# Altium project MainBoard_V100.PrjPcb (part 3 of 3)
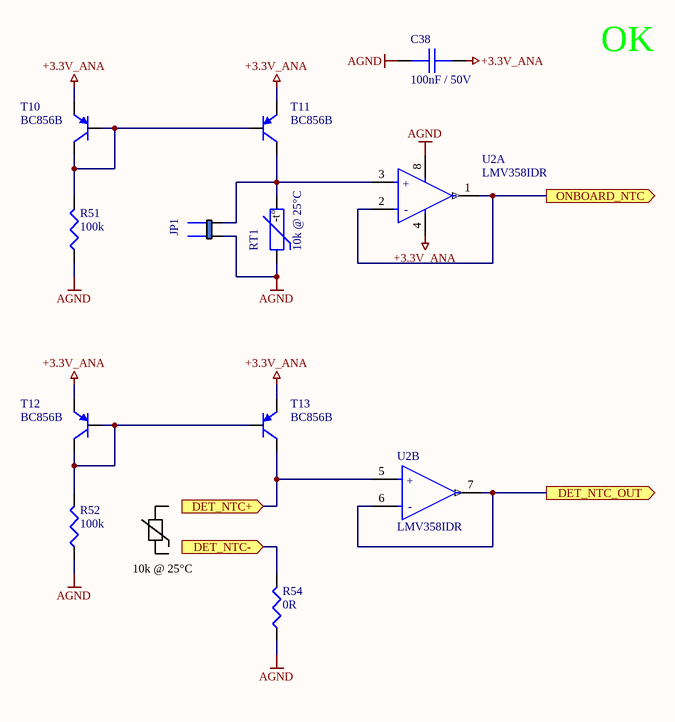
[diagram p22: MainBoard_V100_TEMP.SchDoc]

## Nets that join several sheets
+3.3V: MainBoard_V100_PSU_DIG (S7.2), MainBoard_V100_CHARGER (R72.2), MainBoard_V100_CON (12 pins), MainBoard_V100_MEM (6 pins), MainBoard_V100_ON_OFF (T5.3), MainBoard_V100_SD (8 pins), MainBoard_V100_PER (D5.K LS1.1), MainBoard_V100_MCU (23 pins), MainBoard_V100_BLE (C54.2 C55.2 R59.2 U23.14), MainBoard_V100_DISP (IC2.2)
+3.3V_ANA: MainBoard_V100_PSU_AFE (S5.2), MainBoard_V100_BLR (C46.1 U18.7), MainBoard_V100_CSP (C59.1 C60.1 U3.7 U4.7), MainBoard_V100_PEAKDET (10 pins), MainBoard_V100_MCU (U11.21), MainBoard_V100_TEMP (6 pins)
+3.3V_REF: MainBoard_V100_PSU_AFE (U17.2), MainBoard_V100_MCU (U11.20)
+5V: MainBoard_V100_PSU_AFE (C39.1 U14.1), MainBoard_V100_PSU_5V (S8.2)
+V_AUX: MainBoard_V100_ON_OFF (12 pins), MainBoard_V100_USB_MUX (C56.2 U22.10)
+VBAT: MainBoard_V100_CHARGER (5 pins), MainBoard_V100_ON_OFF (C9.2 U7.1 U7.3)
+VBAT_AUX: MainBoard_V100_CHARGER (BH2.1), MainBoard_V100_MCU (D7.A)
+VBUS: MainBoard_V100_PSU (R70.2 S1.2), MainBoard_V100_PSU_DIG (C49.1 C50.1 IC1.4 IC1.5), MainBoard_V100_PSU_DET (C25.1 L2.1 R38.2 U15.6), MainBoard_V100_PSU_5V (C16.1 C33.1 IC4.4 IC4.5)
+VDET: MainBoard_V100_PSU_DET (S4.2), MainBoard_V100_CON (CON5.1 CON5.2)
+VSYS: MainBoard_V100_PSU (R1.2 T1.3), MainBoard_V100_CHARGER (C15.2 C17.2 U12.15 U12.16)
+VUSB: MainBoard_V100_CHARGER (C14.2 R31.1 R115.2 U12.23), MainBoard_V100_CON (D1.5 S2.2)
-3.3V_ANA: MainBoard_V100_PSU_AFE (S6.2), MainBoard_V100_BLR (C48.2 R124.1 R125.1 U18.4), MainBoard_V100_CSP (C63.2 C64.2 U3.4 U4.4), MainBoard_V100_PEAKDET (C65.2 C82.2 U1.4 U20.4)
AGND: MainBoard_V100_PSU_DET (6 pins), MainBoard_V100_PSU_AFE (21 pins), MainBoard_V100_CON (CON5.5 CON5.6 CON5.9 CON5.10), MainBoard_V100_BLR (C46.2 C48.1 R123.1 U18.3), MainBoard_V100_CSP (8 pins), MainBoard_V100_PEAKDET (13 pins), MainBoard_V100_MCU (FB3.2 U11.19), MainBoard_V100_TEMP (7 pins)
GND: MainBoard_V100_PSU (C94.2 R2.1 R71.1 T2.2), MainBoard_V100_PSU_DIG (5 pins), MainBoard_V100_PSU_DET (8 pins), MainBoard_V100_PSU_AFE (C39.2 FB7.1 U14.2), MainBoard_V100_CHARGER (22 pins), MainBoard_V100_PSU_5V (5 pins), MainBoard_V100_CON (29 pins), MainBoard_V100_MEM (C7.1 U6.4), MainBoard_V100_ON_OFF (12 pins), MainBoard_V100_SD (9 pins), MainBoard_V100_USB_MUX (C56.1 R62.1 R113.1 U22.5), MainBoard_V100_PER (5 pins), MainBoard_V100_MCU (28 pins), MainBoard_V100_BLE (C54.1 C55.1 U23.2 U23.13), MainBoard_V100_DISP (IC2.1 IC2.40 R112.1)
#BLE_RST: MainBoard_V100_MCU (U11.96), MainBoard_V100_BLE (R59.1 U23.10)
BUTTON_0: MainBoard_V100_PER (CON4.9), MainBoard_V100_MCU (U11.4)
BUTTON_1: MainBoard_V100_PER (CON4.8), MainBoard_V100_MCU (U11.3)
BUTTON_2: MainBoard_V100_PER (CON4.7), MainBoard_V100_MCU (U11.2)
BUTTON_3: MainBoard_V100_PER (CON4.6), MainBoard_V100_MCU (U11.1)
BUTTON_4: MainBoard_V100_PER (CON4.5), MainBoard_V100_MCU (U11.89)
BUTTON_5: MainBoard_V100_PER (CON4.4), MainBoard_V100_MCU (U11.34)
BUTTON_6: MainBoard_V100_PER (CON4.3), MainBoard_V100_MCU (U11.33)
BUTTON_7: MainBoard_V100_PER (CON4.2), MainBoard_V100_MCU (U11.32)
BUTTON_8: MainBoard_V100_ON_OFF (D4.A R20.1 R21.1), MainBoard_V100_PER (CON4.1)
DET_NTC+: MainBoard_V100_CON (CON5.11 CON5.12 D10.3), MainBoard_V100_TEMP (T13.3 U2.5)
DET_NTC-: MainBoard_V100_CON (CON5.13 CON5.14 D11.3), MainBoard_V100_TEMP (R54.2)
LCD_A16: MainBoard_V100_MCU (R106.2), MainBoard_V100_DISP (IC2.24)
LCD_D0: MainBoard_V100_MCU (R110.2), MainBoard_V100_DISP (IC2.3)
LCD_D1: MainBoard_V100_MCU (R111.2), MainBoard_V100_DISP (IC2.4)
LCD_D2: MainBoard_V100_MCU (R91.2), MainBoard_V100_DISP (IC2.5)
LCD_D3: MainBoard_V100_MCU (R92.2), MainBoard_V100_DISP (IC2.6)
LCD_D4: MainBoard_V100_MCU (R96.1), MainBoard_V100_DISP (IC2.7)
LCD_D5: MainBoard_V100_MCU (R97.1), MainBoard_V100_DISP (IC2.8)
LCD_D6: MainBoard_V100_MCU (R99.1), MainBoard_V100_DISP (IC2.9)
LCD_D7: MainBoard_V100_MCU (R101.1), MainBoard_V100_DISP (IC2.10)
LCD_D8: MainBoard_V100_MCU (R103.1), MainBoard_V100_DISP (IC2.11)
LCD_D9: MainBoard_V100_MCU (R105.1), MainBoard_V100_DISP (IC2.12)
LCD_D10: MainBoard_V100_MCU (R107.1), MainBoard_V100_DISP (IC2.13)
LCD_D11: MainBoard_V100_MCU (R108.1), MainBoard_V100_DISP (IC2.14)
LCD_D12: MainBoard_V100_MCU (R109.1), MainBoard_V100_DISP (IC2.15)
LCD_D13: MainBoard_V100_MCU (R100.2), MainBoard_V100_DISP (IC2.16)
LCD_D14: MainBoard_V100_MCU (R102.2), MainBoard_V100_DISP (IC2.17)
LCD_D15: MainBoard_V100_MCU (R104.2), MainBoard_V100_DISP (IC2.18)
LCD_NE: MainBoard_V100_MCU (R93.2), MainBoard_V100_DISP (IC2.23)
LCD_NOE: MainBoard_V100_MCU (R95.2), MainBoard_V100_DISP (IC2.26)
LCD_NWE: MainBoard_V100_MCU (R94.2), MainBoard_V100_DISP (IC2.25)
LCD_TE: MainBoard_V100_MCU (U11.59), MainBoard_V100_DISP (IC2.22)
NetCON7_1: MainBoard_V100_CON (CON7.1), MainBoard_V100_MCU (U11.31)
NetCON7_2: MainBoard_V100_CON (CON7.2), MainBoard_V100_MCU (U11.67)
NetCON7_3: MainBoard_V100_CON (CON7.3), MainBoard_V100_MCU (U11.60)
NRST: MainBoard_V100_CON (CON2.15), MainBoard_V100_MCU (C79.1 R64.1 SW1.2 U11.14)
ON_OFF_INT: MainBoard_V100_ON_OFF (R24.2 T5.2), MainBoard_V100_MCU (U11.87)
PEAK_DET_RST: MainBoard_V100_PEAKDET (R15.2 T3.1), MainBoard_V100_MCU (U11.24)
PULSE_COUNT: MainBoard_V100_PEAKDET (R63.1 U5.7), MainBoard_V100_MCU (U11.97)
SCL: MainBoard_V100_CON (CON5.17 CON5.18 D15.3), MainBoard_V100_MEM (U6.6), MainBoard_V100_MCU (R86.2 U11.92)
SD_DETECT: MainBoard_V100_SD (CON3.CD1 R49.1), MainBoard_V100_MCU (U11.84)
SDA: MainBoard_V100_CON (CON5.15 CON5.16 D14.3), MainBoard_V100_MEM (U6.5), MainBoard_V100_MCU (R87.2 U11.93)
SDMMC_CLK: MainBoard_V100_SD (CON3.5), MainBoard_V100_MCU (R85.1)
SDMMC_CMD: MainBoard_V100_SD (CON3.3 R76.1), MainBoard_V100_MCU (R98.2)
SDMMC_DATA0: MainBoard_V100_SD (CON3.7 R75.1), MainBoard_V100_MCU (R69.1)
SDMMC_DATA1: MainBoard_V100_SD (CON3.8 R74.1), MainBoard_V100_MCU (R81.1)
SDMMC_DATA2: MainBoard_V100_SD (CON3.1 R78.1), MainBoard_V100_MCU (R83.1)
SDMMC_DATA3: MainBoard_V100_SD (CON3.2 R77.1), MainBoard_V100_MCU (R84.1)
SWDIO: MainBoard_V100_CON (CON2.7), MainBoard_V100_MCU (U11.72)
TRESHHOLD_IRQ: MainBoard_V100_PEAKDET (R14.1 U5.1), MainBoard_V100_MCU (U11.22 U11.77)
USB_IN_SEL: MainBoard_V100_USB_MUX (R113.2 U22.1), MainBoard_V100_MCU (U11.91)
USB_MCU_D_N: MainBoard_V100_USB_MUX (U22.7), MainBoard_V100_MCU (U11.70)
USB_MCU_D_P: MainBoard_V100_USB_MUX (U22.3), MainBoard_V100_MCU (U11.71)
V_DET_TOOGLE: MainBoard_V100_PSU_DET (R41.2 T7.1), MainBoard_V100_MCU (U11.5)
VBUS_MEAS: MainBoard_V100_PSU (C94.1 R70.1 R71.2), MainBoard_V100_MCU (U11.15)